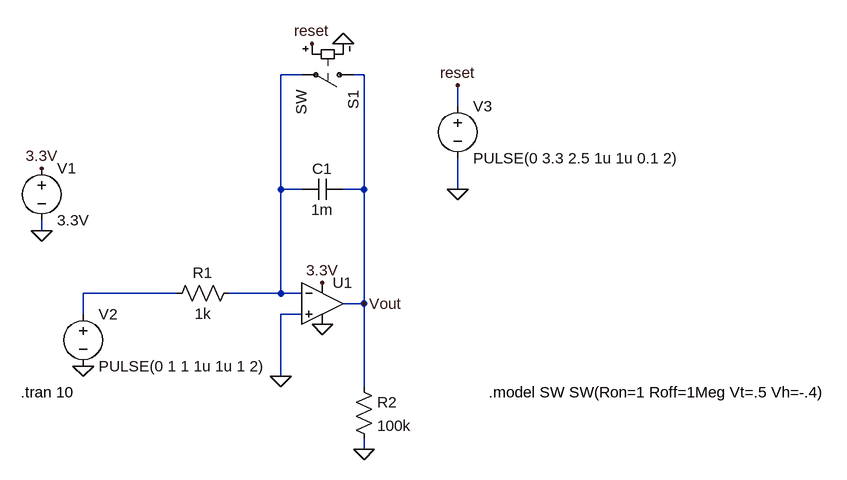
[diagram p0: schematic pixel.asc]
pixel.asc, the LTspice schematic file:
Version 4
SHEET 1 920 680
WIRE 64 -112 32 -112
WIRE 160 -112 144 -112
WIRE 304 -64 304 -96
WIRE 32 64 32 -112
WIRE 64 64 32 64
WIRE 160 64 160 -112
WIRE 160 64 128 64
WIRE 304 64 304 16
WIRE -336 128 -336 112
WIRE -128 224 -272 224
WIRE 32 224 32 64
WIRE 32 224 -48 224
WIRE 64 224 32 224
WIRE 160 240 160 64
WIRE 160 240 128 240
WIRE -272 256 -272 224
WIRE 64 256 32 256
WIRE 32 352 32 256
WIRE 160 368 160 240
WIRE 160 464 160 448
FLAG 32 352 0
FLAG 96 272 0
FLAG 96 208 3.3V
FLAG -336 128 0
FLAG -336 32 3.3V
FLAG -272 336 0
FLAG 160 240 Vout
FLAG 304 64 0
FLAG 80 -160 reset
FLAG 304 -96 reset
FLAG 160 464 0
FLAG 128 -160 0
SYMBOL OpAmps\\UniversalOpAmp 96 240 R0
SYMATTR InstName U1
SYMBOL cap 128 48 R90
WINDOW 0 0 32 VBottom 2
WINDOW 3 32 32 VTop 2
SYMATTR InstName C1
SYMATTR Value 1m
SYMBOL voltage -336 16 R0
WINDOW 123 0 0 Left 0
WINDOW 39 0 0 Left 0
SYMATTR InstName V1
SYMATTR Value 3.3V
SYMBOL voltage -272 240 R0
WINDOW 123 0 0 Left 0
WINDOW 39 0 0 Left 0
SYMATTR InstName V2
SYMATTR Value PULSE(0 1 1 1u 1u 1 2)
SYMBOL res -32 208 R90
WINDOW 0 0 56 VBottom 2
WINDOW 3 32 56 VTop 2
SYMATTR InstName R1
SYMATTR Value 1k
SYMBOL voltage 304 -80 R0
WINDOW 123 0 0 Left 0
WINDOW 39 0 0 Left 0
SYMATTR InstName V3
SYMATTR Value PULSE(0 3.3 2.5 1u 1u 0.1 2)
SYMBOL res 144 352 R0
SYMATTR InstName R2
SYMATTR Value 100k
SYMBOL sw 160 -112 R90
SYMATTR InstName S1
TEXT -368 376 Left 2 !.tran 10
TEXT 352 376 Left 2 !.model SW SW(Ron=1 Roff=1Meg Vt=.5 Vh=-.4)

The netlist it stands for:
* pixel.asc
XU1 0 N001 3.3V 0 Vout level1 Avol=1Meg GBW=10Meg Vos=0 En=0 Enk=0 In=0 Ink=0 Rin=500Meg  ; pins In+ In- V+ V- OUT
C1 Vout N001 1m
V1 3.3V 0 3.3V
V2 N002 0 PULSE(0 1 1 1u 1u 1 2)
R1 N001 N002 1k
V3 reset 0 PULSE(0 3.3 2.5 1u 1u 0.1 2)
R2 Vout 0 100k
S1 Vout N001 reset 0 SW
.tran 10
.model SW SW(Ron=1 Roff=1Meg Vt=.5 Vh=-.4)
.lib UniversalOpAmp1.lib
.backanno
.end